# Altium schematic sheet samd21.SchDoc: Microcontroller
size A; Engineer: A. Peck; Organization: UCLA High Energy Physics; DocumentNumber: 3; Revision: 3.0; SheetNumber: 3; SheetTotal: 15; Project: LCT Comparator Tester
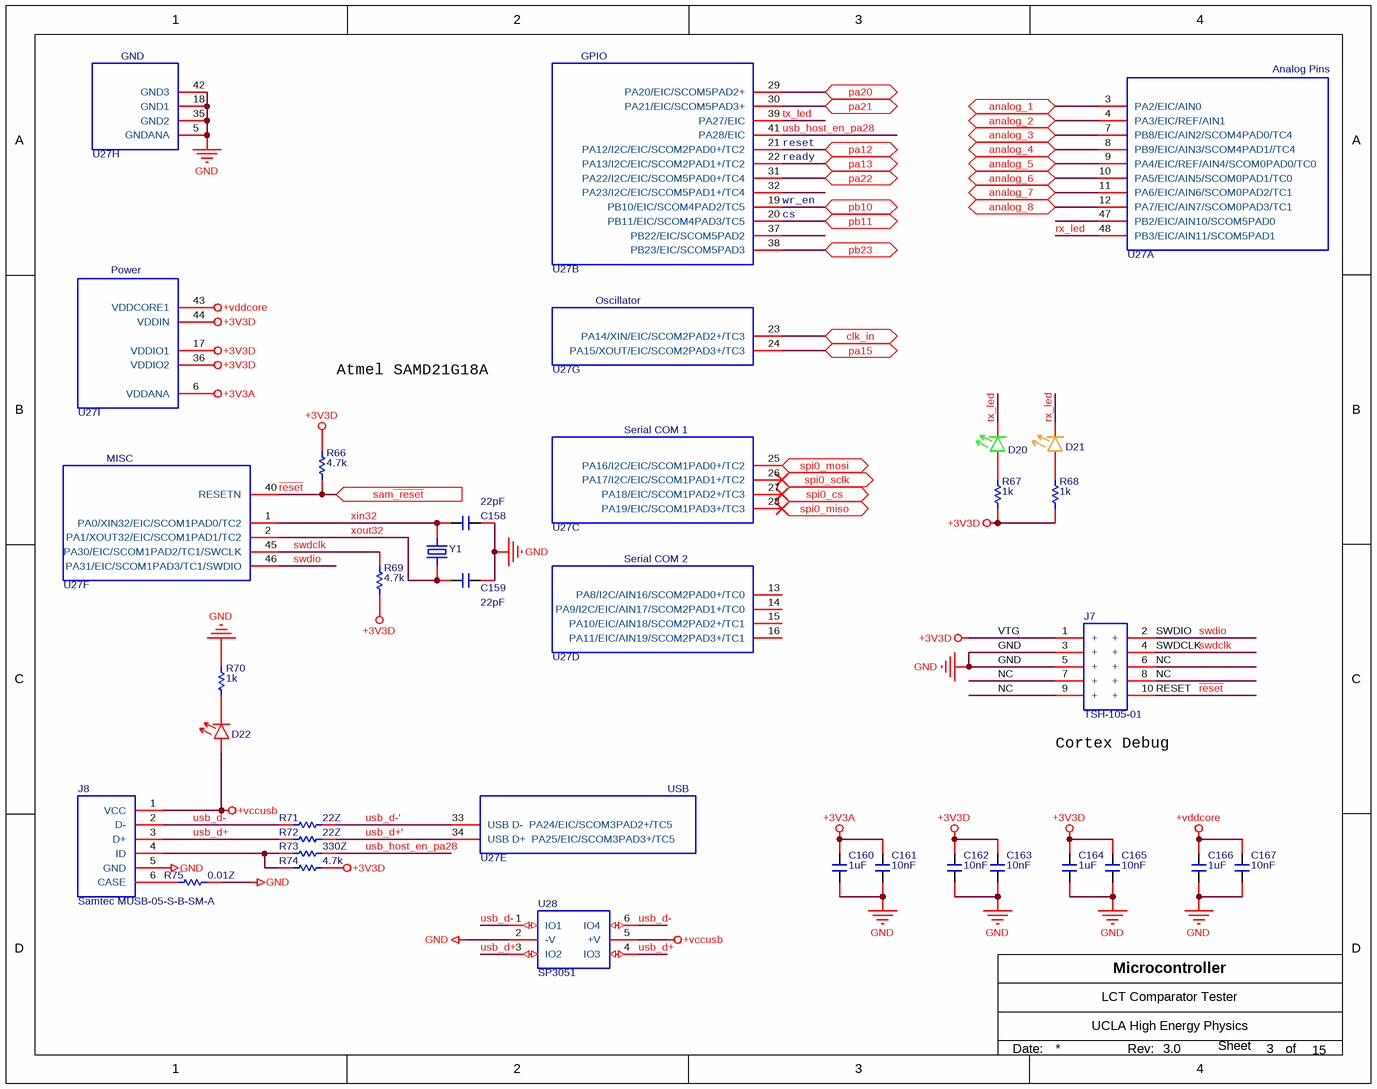
[diagram p0: samd21.SchDoc]

## Parts
C158  22pF  [C0603]
C159  22pF  [C0603]
C160  1uF  [C0603]
C161  10nF  [C0603]
C162  10nF  [C0603]
C163  10nF  [C0603]
C164  1uF  [C0603]
C165  10nF  [C0603]
C166  1uF  [C0603]
C167  10nF  [C0603]
D20  LITEON/LTST-C191KGKT  [LED0603]  (value not drawn)
D21  Vishay/TLMO1000-GS08  [LED0603]  (value not drawn)
D22  Vishay/TLMS1000-GS08  [LED0603]  (value not drawn)
J7  TSH-105-01  [Samtec/FTSH-105-XX-XXX-DV-A]
J8  Samtec MUSB-05-S-B-SM-A  [MUSB-05-S-B-SM-A]
R66  4.7k  [R0603]
R67  1k  [R0603]
R68  1k  [R0603]
R69  4.7k  [R0603]
R70  1k  [R0603]
R71  22Z  [R0402]
R72  22Z  [R0402]
R73  330Z  [R0603]
R74  4.7k  [R0603]
R75  0.01Z  [R1206]
U27  SAMD21G18A-AUT  [TSQFP50P900X900X120-48N]  (value not drawn)  (parts A,B,C,D,E,F,G,H,I of 9)
U28  SP3051  [SOT23-6]
Y1  32.768 kHz  [ABRACON ABS07]  (value not drawn)

## Ports
analog_1 (bidir), analog_2 (bidir), analog_3 (bidir), analog_4 (bidir), analog_5 (bidir), analog_6 (bidir), analog_7 (bidir), analog_8 (bidir), clk_in (bidir), pa12 (bidir), pa13 (bidir), pa15 (bidir), pa20 (bidir), pa21 (bidir), pa22 (bidir), pb10 (bidir), pb11 (bidir), pb23 (bidir), sam~{_reset} (in), spi0_cs (out), spi0_miso (in), spi0_mosi (out), spi0_sclk (out)

## Nets
+3V3A: C160.2 C161.1 U27.6(VDDANA)
+3V3D: C162.2 C163.1 C164.1 C165.1 J7.1(+) R66.2 R67.1 R68.1 R69.1 R74.2 U27.17(VDDIO1) U27.36(VDDIO2) U27.44(VDDIN)
+vccusb: D22.A J8.1(VCC) U28.5(+V)
+vddcore: C166.1 C167.1 U27.43(VDDCORE1)
GND: C158.2 C159.2 C160.1 C161.2 C162.1 C163.2 C164.2 C165.2 C166.2 C167.2 J7.3(+) J7.5(+) J8.5(GND) R70.1 R75.2 U27.5(GNDANA) U27.18(GND1) U27.35(GND2) U27.42(GND3) U28.2(-V)
~{reset}: J7.10(+) R66.1 U27.40(RESETN) ; port sam~{_reset}
analog_1: U27.3(PA2/EIC/AIN0) ; port analog_1
analog_2: U27.4(PA3/EIC/REF/AIN1) ; port analog_2
analog_3: U27.7(PB8/EIC/AIN2/SCOM4PAD0/TC4) ; port analog_3
analog_4: U27.8(PB9/EIC/AIN3/SCOM4PAD1//TC4) ; port analog_4
analog_5: U27.9(PA4/EIC/REF/AIN4/SCOM0PAD0/TC0) ; port analog_5
analog_6: U27.10(PA5/EIC/AIN5/SCOM0PAD1/TC0) ; port analog_6
analog_7: U27.11(PA6/EIC/AIN6/SCOM0PAD2/TC1) ; port analog_7
analog_8: U27.12(PA7/EIC/AIN7/SCOM0PAD3/TC1) ; port analog_8
clk_in: U27.23(PA14/XIN/EIC/SCOM2PAD2+/TC3) ; port clk_in
pa12: U27.21(PA12/I2C/EIC/SCOM2PAD0+/TC2) ; port pa12
pa13: U27.22(PA13/I2C/EIC/SCOM2PAD1+/TC2) ; port pa13
pa15: U27.24(PA15/XOUT/EIC/SCOM2PAD3+/TC3) ; port pa15
pa20: U27.29(PA20/EIC/SCOM5PAD2+) ; port pa20
pa21: U27.30(PA21/EIC/SCOM5PAD3+) ; port pa21
pa22: U27.31(PA22/I2C/EIC/SCOM5PAD0+/TC4) ; port pa22
pb10: U27.19(PB10/EIC/SCOM4PAD2/TC5) ; port pb10
pb11: U27.20(PB11/EIC/SCOM4PAD3/TC5) ; port pb11
pb23: U27.38(PB23/EIC/SCOM5PAD3) ; port pb23
rx_led: D21.C U27.48(PB3/EIC/AIN11/SCOM5PAD1)
spi0_cs: U27.27(PA18/EIC/SCOM1PAD2+/TC3) ; port spi0_cs
spi0_miso: U27.28(PA19/EIC/SCOM1PAD3+/TC3) ; port spi0_miso
spi0_mosi: U27.25(PA16/I2C/EIC/SCOM1PAD0+/TC2) ; port spi0_mosi
spi0_sclk: U27.26(PA17/I2C/EIC/SCOM1PAD1+/TC2) ; port spi0_sclk
swdclk: J7.4(+) R69.2 U27.45(PA30/EIC/SCOM1PAD2/TC1/SWCLK)
swdio: J7.2(+) U27.46(PA31/EIC/SCOM1PAD3/TC1/SWDIO)
tx_led: D20.C U27.39(PA27/EIC)
usb_d+: J8.3(D+) R72.1 U28.3(IO2) U28.4(IO3)
usb_d+': R72.2 U27.34(USB_D+__PA25/EIC/SCOM3PAD3+/TC5)
usb_d-: J8.2(D-) R71.1 U28.1(IO1) U28.6(IO4)
usb_d-': R71.2 U27.33(USB_D-__PA24/EIC/SCOM3PAD2+/TC5)
usb_host_en_pa28: R73.2 U27.41(PA28/EIC)
xin32: C158.1 U27.1(PA0/XIN32/EIC/SCOM1PAD0/TC2) Y1.2
xout32: C159.1 U27.2(PA1/XOUT32/EIC/SCOM1PAD1/TC2) Y1.1
NetD20_A: D20.A R67.2
NetD21_A: D21.A R68.2
NetD22_C: D22.C R70.2
NetJ8_4: J8.4(ID) R73.1 R74.1
NetJ8_6: J8.6(CASE) R75.1

Not connected (* = marked no-connect by the designer): J7 6(+) 7(+) 8(+) 9(+); U27 13(PA8/I2C/AIN16/SCOM2PAD0+/TC0) 14(PA9/I2C/EIC/AIN17/SCOM2PAD1+/TC0) 15(PA10/EIC/AIN18/SCOM2PAD2+/TC1) 16(PA11/EIC/AIN19/SCOM2PAD3+/TC1) 32(PA23/I2C/EIC/SCOM5PAD1+/TC4) 37(PB22/EIC/SCOM5PAD2) 47(PB2/EIC/AIN10/SCOM5PAD0)

## Notes on the sheet
- (near U27) reset
- (near U27) ready
- (near U27) wr_en
- (near U27) cs
- Atmel SAMD21G18A
- NC
- GND
- VTG
- (near J7) SWDCLK
- (near J7) SWDIO
- (near J7) NC
- (near J7) Cortex Debug
- (near J7) RESET
- Date:
- Rev:
- of
- Sheet
- (in symbol Atmel/SAMD21G18A, part A) Analog Pins
- (in symbol Atmel/SAMD21G18A, part B) GPIO
- (in symbol Atmel/SAMD21G18A, part C) Serial COM 1
- (in symbol Atmel/SAMD21G18A, part D) Serial COM 2
- (in symbol Atmel/SAMD21G18A, part E) USB
- (in symbol Atmel/SAMD21G18A, part F) MISC
- (in symbol Atmel/SAMD21G18A, part G) Oscillator
- (in symbol Atmel/SAMD21G18A, part H) GND
- (in symbol Atmel/SAMD21G18A, part I) Power

## Library data of the parts
C158 C159 = CAP/C0603C220J1GACTU: CAP-CER, 0, 22pF, 10%, 100V, 0603, NP0; Manufacturer: Kemet; Tolerance: ±5%; Temperature Coefficient: C0G, NP0; Supplier 1: Digi-Key; Manufacturer Part Number: C0603C220J1GACTU; RoHS: RoHS Compliant; Category: Capacitors; Stock 1: 315216; Pricing 1: 1=0.1, 10=0.041, 50=0.0222, 100=0.0187, 250=0.01532, 500=0.0131, 1000=0.0102 (USD); Packaging: Cut Tape (CT); Capacitance: 22pF; Voltage - Rated: 100V; Mounting Type: Surface Mount, MLCC; Operating Temperature: -55°C ~ 125°C; Applications: General Purpose; Ratings: -; Package / Case: 0603 (1608 Metric); Size / Dimension: 0.063" L x 0.031" W (1.60mm x 0.80mm); Height - Seated (Max): -; Thickness (Max): 0.034" (0.87mm); Lead Spacing: -; Features: Low ESL; Lead Style: -; ComponentLink1URL: http://www.kemet.com/docfinder?Partnumber=C0603C220J1GACTU; ComponentLink1Description: http://www.kemet.com/docfinder?Partnumber=C0603C220J1GACTU; Supplier 2: Newark; Supplier Part Number 1: 399-7874-1-ND; Supplier Part Number 2: 06R5147
C160 C164 C166 = Murata/GRM188R61E105KA12D: CAP-CER, 2, 1.0uF, 10%, 25V, 0603; Manufacturer: Murata Electronics North America; Capacitance: 1µF; Temperature Coefficient: X5R; Supplier 1: Digi-Key; Supplier Part Number 1: 490-3897-1-ND; Manufacturer Part Number: GRM188R61E105KA12D; RoHS: RoHS Compliant; Category: Capacitors; Stock 1: 1899119; Pricing 1: 1=0.1, 10=0.036, 50=0.0196, 100=0.0165, 250=0.01352, 500=0.01156, 1000=0.009 (USD); Packaging: Cut Tape (CT); Tolerance: ±10%; Voltage - Rated: 25V; Mounting Type: Surface Mount, MLCC; Operating Temperature: -55°C ~ 85°C; Applications: General Purpose; Ratings: -; Package / Case: 0603 (1608 Metric); Size / Dimension: 0.063" L x 0.031" W (1.60mm x 0.80mm); Height - Seated (Max): -; Thickness (Max): 0.035" (0.90mm); Lead Spacing: -; Features: -; Lead Style: -; ComponentLink1URL: http://www.murata.com/~/media/webrenewal/support/library/catalog/products/capacitor/mlcc/c02e.pdf; ComponentLink1Description: http://www.murata.com/~/media/webrenewal/support/library/catalog/products/capacitor/mlcc/c02e.pdf
C161-C163 C165 C167 = CAP/GRM188R71H103KA01D: CAP-CER, 2, 0.01uF, 10%, 50V, X7R, 0603; Manufacturer: Murata Electronics North America; Capacitance: 10000pF; Supplier 1: Digi-Key; Manufacturer Part Number: GRM188R71H103KA01D; RoHS: RoHS Compliant; Category: Capacitors; Stock 1: 3035311; Pricing 1: 1=0.1, 10=0.019, 50=0.01, 100=0.0085, 250=0.00696, 500=0.00596, 1000=0.00465 (USD); Packaging: Cut Tape (CT); Tolerance: ±10%; Voltage - Rated: 50V; Temperature Coefficient: X7R; Mounting Type: Surface Mount, MLCC; Operating Temperature: -55°C ~ 125°C; Applications: General Purpose; Ratings: -; Package / Case: 0603 (1608 Metric); Size / Dimension: 0.063" L x 0.031" W (1.60mm x 0.80mm); Height - Seated (Max): -; Thickness (Max): 0.035" (0.90mm); Lead Spacing: -; Features: -; Lead Style: -; ComponentLink1URL: http://www.murata.com/~/media/webrenewal/support/library/catalog/products/capacitor/mlcc/c02e.pdf; ComponentLink1Description: http://www.murata.com/~/media/webrenewal/support/library/catalog/products/capacitor/mlcc/c02e.pdf; Supplier Part Number 1: 490-1512-1-ND; Supplier 2: Newark; Supplier Part Number 2: 38K1669
D20 = LITEON/LTST-C191KGKT: LED, 20mA, 0603, Green; Supplier 1: Digi-Key; Supplier Part Number 1: 160-1446-1-ND
D21 = Vishay/TLMO1000-GS08: LED, 2mA, 0603, Soft Orange; Manufacturer: Vishay Semiconductor Opto Division; Millicandela Rating: 7.5mcd; Lens Style/Size: Rectangle with Flat Top, 1.60mm x 0.80mm; Voltage - Forward (Vf) (Typ): 1.8V; Viewing Angle: 160°; Wavelength - Dominant: 605nm; Wavelength - Peak: 610nm; Supplier 1: Digi-Key; Manufacturer Part Number: TLMO1000-GS08; RoHS: RoHS Compliant; Category: Optoelectronics; Stock 1: 182; Pricing 1: 1=0.52, 10=0.372, 25=0.304, 100=0.2432, 250=0.20524, 500=0.17482, 1000=0.13682 (USD); Packaging: Cut Tape (CT); Color: Orange; Lens Color: -; Lens Transparency: -; Current - Test: 2mA; Mounting Type: Surface Mount; Features: -; Package / Case: 0603 (1608 Metric); Supplier Device Package: 0603; Size / Dimension: 1.60mm L x 0.80mm W; Height (Max): 0.65mm; ComponentLink1URL: http://www.vishay.com/docs/83172/tlmo1000.pdf; ComponentLink1Description: http://www.vishay.com/docs/83172/tlmo1000.pdf; Supplier Part Number 1: TLMO1000-GS08CT-ND
D22 = Vishay/TLMS1000-GS08: LED, 2mA, 0603, Red; Manufacturer: Vishay Semiconductor Opto Division; Millicandela Rating: 4mcd; Lens Style/Size: Rectangle with Flat Top, 1.60mm x 0.80mm; Voltage - Forward (Vf) (Typ): 1.8V; Viewing Angle: 160°; Wavelength - Dominant: 628nm; Wavelength - Peak: 640nm; Supplier 1: Digi-Key; Manufacturer Part Number: TLMS1000-GS08; RoHS: RoHS Compliant; Category: Optoelectronics; Stock 1: 12598; Pricing 1: 1=0.52, 10=0.372, 25=0.304, 100=0.2432, 250=0.20524, 500=0.17482, 1000=0.13682 (USD); Packaging: Cut Tape (CT); Color: Red; Lens Color: -; Lens Transparency: -; Current - Test: 2mA; Mounting Type: Surface Mount; Features: -; Package / Case: 0603 (1608 Metric); Supplier Device Package: 0603; Size / Dimension: 1.60mm L x 0.80mm W; Height (Max): 0.65mm; ComponentLink1URL: http://www.vishay.com/docs/83172/tlmo1000.pdf; ComponentLink1Description: http://www.vishay.com/docs/83172/tlmo1000.pdf; Supplier 2: Newark; Supplier Part Number 1: TLMS1000-GS08CT-ND; Supplier Part Number 2: 35M3052
J7 = Samtec/TSH-105-01: Header, 1.27mm, 02x05; Manufacturer: Samtec Inc.; Manufacturer Part Number: FTSH-105-01-F-DV-K; Connector Type: Header, Shrouded; Number of Positions: 10; Number of Positions Loaded: All; Pitch: 0.050" (1.27mm); Supplier 1: Digi-Key; RoHS: RoHS Compliant; Category: Connectors, Interconnects; Stock 1: 4301; Pricing 1: 1=3.02, 10=2.552, 50=2.204, 100=1.972, 250=1.74, 500=1.624, 1000=1.508, 2500=1.45, 5000=1.421 (USD); Packaging: Tube; Contact Type: Male Pin; Number of Rows: 2; Row Spacing: 0.050" (1.27mm); Contact Mating Length: 0.120" (3.05mm); Mounting Type: Surface Mount; Termination: Solder; Fastening Type: -; Features: -; Contact Finish: Gold; Contact Finish Thickness: 3µin (0.08µm); Color: Black; ComponentLink1URL: http://suddendocs.samtec.com/prints/ftsh-1xx-xx-xxx-dv-xxx-mkt.pdf; ComponentLink1Description: http://suddendocs.samtec.com/prints/ftsh-1xx-xx-xxx-dv-xxx-mkt.pdf; Supplier Part Number 1: SAM8796-ND
J8 = Samtec/MUSB-05-S-B-SM-A: USB, Mini-USB, SMD; Manufacturer: Samtec Inc.; Connector Type: USB - mini B; Number of Contacts: 5; Gender: Receptacle; Specifications: USB 2.0; Supplier 1: Digi-Key; Manufacturer Part Number: MUSB-05-S-B-SM-A; RoHS: RoHS Compliant; Stock 1: 1209; Pricing 1: 1=1.48, 10=1.222, 50=1.018, 100=0.9162, 250=0.84496, 500=0.7635, 1000=0.67697, 2500=0.64898, 5000=0.63625 (USD); ComponentLink1URL: http://suddendocs.samtec.com/prints/musb-05-x-b-sm-a-x-xx-mkt.pdf; ComponentLink1Description: http://suddendocs.samtec.com/prints/musb-05-x-b-sm-a-x-xx-mkt.pdf; Supplier Part Number 1: SAM8841-ND; Category: Connectors, Interconnects; Packaging: Tray; Mounting Type: Surface Mount, Right Angle, Horizontal; Features: Board Guide, Solder Retention; Ingress Protection: -
R66 R69 R74 = CRCW06034K70FKEA: RES1, SMD, 4.70k, 1.0%, 1/10W, 0603; Manufacturer: Vishay Dale; Tolerance: ±1%; Power (Watts): 0.1W, 1/10W; Temperature Coefficient: ±100ppm/°C; Supplier 1: Digi-Key; Manufacturer Part Number: CRCW06034K70FKEA; RoHS: RoHS Compliant; Category: Resistors; Stock 1: 413202; Pricing 1: 1=0.1, 10=0.03, 25=0.022, 50=0.0168, 100=0.0123, 250=0.0094, 500=0.00752, 1000=0.00554, 2500=0.00481 (USD); Packaging: Cut Tape (CT); Resistance (Ohms): 4.7k; Composition: Thick Film; Features: Automotive AEC-Q200; Operating Temperature: -55°C ~ 155°C; Package / Case: 0603 (1608 Metric); Supplier Device Package: 0603; Size / Dimension: 0.063" L x 0.033" W (1.60mm x 0.85mm); Number of Terminations: 2; ComponentLink1URL: http://www.vishay.com/docs/20035/dcrcwe3.pdf; ComponentLink1Description: http://www.vishay.com/docs/20035/dcrcwe3.pdf; Supplier Part Number 1: 541-4.70KHCT-ND; Part Status: Active; Height - Seated (Max): 0.020" (0.50mm); Failure Rate: -
R67 R68 R70 = CRCW06031K00FKEA: RES1, SMD, 1.00k, 1.0%, 1/10W, 0603; Manufacturer: Vishay Dale; Tolerance: ±1%; Power (Watts): 0.1W, 1/10W; Temperature Coefficient: ±100ppm/°C; Supplier 1: Digi-Key; Supplier Part Number 1: 541-1.00KHCT-ND; Manufacturer Part Number: CRCW06031K00FKEA; RoHS: RoHS Compliant; Category: Resistors; Stock 1: 770011; Pricing 1: 1=0.1, 10=0.03, 25=0.022, 50=0.0168, 100=0.0123, 250=0.0094, 500=0.00752, 1000=0.00554, 2500=0.00481 (USD); Packaging: Cut Tape (CT); Resistance (Ohms): 1k; Composition: Thick Film; Features: Automotive AEC-Q200; Operating Temperature: -55°C ~ 155°C; Package / Case: 0603 (1608 Metric); Supplier Device Package: 0603; Size / Dimension: 0.061" L x 0.033" W (1.55mm x 0.85mm); Height: 0.020" (0.50mm); Number of Terminations: 2; ComponentLink1URL: http://www.vishay.com/docs/20035/dcrcwe3.pdf; ComponentLink1Description: http://www.vishay.com/docs/20035/dcrcwe3.pdf; Supplier 2: Newark; Supplier Part Number 2: 52K8015
R71 R72 = RES/ 311-22.0LRCT-ND: RES0, SMD, 22.0Z, 1.0%, 1/16W, 0402; Manufacturer: Yageo; Manufacturer Part Number: RC0402FR-0722RL; Resistance (Ohms): 22; Tolerance: ±1%; Power (Watts): 0.063W, 1/16W; Temperature Coefficient: ±100ppm/°C; RoHS: RoHS Compliant; Category: Resistors; Packaging: Cut Tape (CT); Composition: Thick Film; Features: Moisture Resistant; Operating Temperature: -55°C ~ 155°C; Package / Case: 0402 (1005 Metric); Supplier Device Package: 0402; Size / Dimension: 0.039" L x 0.020" W (1.00mm x 0.50mm); Height: 0.016" (0.40mm); Number of Terminations: 2; ComponentLink1URL: http://www.yageo.com/documents/recent/PYu-RC_Group_51_RoHS_L_04.pdf; ComponentLink1Description: http://www.yageo.com/documents/recent/PYu-RC_Group_51_RoHS_L_04.pdf; Supplier 1: Digi-Key; Stock 1: 1724839; Pricing 1: 1=0.1, 10=0.013, 25=0.0096, 100=0.0054, 250=0.00412, 500=0.00328, 1000=0.00242, 2500=0.0021, 5000=0.00173 (USD); Supplier Part Number 1: 311-22.0LRCT-ND; Supplier 2: Newark; Supplier Part Number 2: 67R9912
R73 = CRCW0603330RFKEA: RES0, SMD,  330Z, 1.0%, 1/10W, 0603; Manufacturer: Rohm Semiconductor; Manufacturer Part Number: MCR03ERTF3300; Resistance (Ohms): 330; Tolerance: ±1%; Power (Watts): 0.1W, 1/10W; Temperature Coefficient: ±100ppm/°C; Supplier 1: Digi-Key; RoHS: RoHS Compliant; Category: Resistors; Stock 1: 139947; Pricing 1: 1=0.1, 10=0.011, 25=0.0084, 100=0.0047, 250=0.00356, 500=0.00286, 1000=0.0021 (USD); Packaging: Cut Tape (CT); Composition: Thick Film; Features: -; Operating Temperature: -55°C ~ 155°C; Package / Case: 0603 (1608 Metric); Supplier Device Package: 0603 (1608 Metric); Size / Dimension: 0.063" L x 0.031" W (1.60mm x 0.80mm); Height: 0.022" (0.55mm); Number of Terminations: 2; ComponentLink1URL: http://rohmfs.rohm.com/en/products/databook/datasheet/passive/resistor/chip_resistor/mcr_g.pdf; ComponentLink1Description: http://rohmfs.rohm.com/en/products/databook/datasheet/passive/resistor/chip_resistor/mcr_g.pdf; Supplier Part Number 1: RHM330CFCT-ND
R75 = RES SMD 0.01 OHM 1% 1W 1206: RES0, SMD, 0.01Z, 1.0%, 1/4W,  1206; Manufacturer: Panasonic Electronic Components; Manufacturer Part Number: ERJ-8BWFR010V; Resistance (Ohms): 0.01; Tolerance: ±1%; Power (Watts): 1W; Temperature Coefficient: ±200ppm/°C; Supplier 1: Digi-Key; RoHS: RoHS Compliant; Category: Resistors; Stock 1: 27187; Pricing 1: 1=0.72, 50=0.464, 100=0.4038, 250=0.36084, 500=0.2921, 1000=0.23625 (USD); Packaging: Cut Tape (CT); Part Status: Active; Composition: Thick Film; Features: Automotive AEC-Q200, Current Sense; Operating Temperature: -55°C ~ 155°C; Package / Case: 1206 (3216 Metric); Supplier Device Package: 1206; Size / Dimension: 0.126" L x 0.063" W (3.20mm x 1.60mm); Height - Seated (Max): 0.030" (0.75mm); Number of Terminations: 2; Failure Rate: -; ComponentLink1URL: https://industrial.panasonic.com/cdbs/www-data/pdf/RDA0000/AOA0000C239.pdf; ComponentLink1Description: https://industrial.panasonic.com/cdbs/www-data/pdf/RDA0000/AOA0000C239.pdf; Supplier Part Number 1: P.010AUCT-ND
U27 = Atmel/SAMD21G18A: Atmel D21 32bit ARM Cortex-M0  microcontroller - 48 PIN TQFP 256KB flash memory + 32KB SRAM; Manufacturer Part Number: ATSAMD21G18A-AUT; Core Processor: ARM® Cortex®-M0+; Core Size: 32-Bit; Speed: 48MHz; Connectivity: I²C, LIN, SPI, UART/USART; Peripherals: Brown-out Detect/Reset, DMA, I²S, POR, PWM, WDT; Number of I/O: 38; Program Memory Size: 256KB (256K x 8); RAM Size: 32K x 8; Voltage - Supply (Vcc/Vdd): 1.62 V ~ 3.6 V; Data Converters: A/D 14x12b, D/A 1x10b; Oscillator Type: Internal; Supplier 1: Digi-Key; Manufacturer: Atmel; RoHS: RoHS Compliant; Category: Integrated Circuits (ICs); Stock 1: 1467; Pricing 1: 1=5.68, 10=5.073, 25=4.5656, 100=4.1599, 250=3.75404, 500=3.36848, 1000=2.84088 (USD); Packaging: Cut Tape (CT); Program Memory Type: FLASH; EEPROM Size: -; Operating Temperature: -40°C ~ 85°C (TA); Package / Case: 48-TQFP; Supplier Device Package: 48-TQFP (7x7); ComponentLink1URL: http://www.atmel.com/Images/Atmel-42181-SAM-D21_Summary.pdf; ComponentLink1Description: http://www.atmel.com/Images/Atmel-42181-SAM-D21_Summary.pdf; Supplier Part Number 1: ATSAMD21G18A-AUTCT-ND
U28 = Littelfuse/SP3051-04HTG: TVS, 6VWM, 16VC; Manufacturer: Littelfuse Inc.; Bidirectional Channels: 4; Voltage - Reverse Standoff (Typ): 6V (Max); Voltage - Breakdown (Min): 8V (Typ); Voltage - Clamping (Max) @ Ipp: 17V; Current - Peak Pulse (10/1000µs): 20A (8/20µs); Power - Peak Pulse: 400W; Power Line Protection: Yes; Supplier 1: Digi-Key; Manufacturer Part Number: SP3051-04HTG; RoHS: RoHS Compliant; Category: Circuit Protection; Stock 1: 7453; Pricing 1: 1=1.05, 10=0.925, 25=0.8352, 100=0.7308, 250=0.64092, 500=0.5684, 1000=0.4495 (USD); Packaging: Cut Tape (CT); Type: Steering (Rail to Rail); Unidirectional Channels: -; Applications: Ethernet; Capacitance @ Frequency: -; Operating Temperature: -40°C ~ 125°C (TJ); Mounting Type: Surface Mount; Package / Case: SOT-23-6; Supplier Device Package: SOT-23-6; ComponentLink1URL: http://www.littelfuse.com/~/media/electronics/datasheets/tvs_diode_arrays/littelfuse_tvs_diode_array_sp3051_datasheet.pdf.pdf; ComponentLink1Description: http://www.littelfuse.com/~/media/electronics/datasheets/tvs_diode_arrays/littelfuse_tvs_diode_array_sp3051_datasheet.pdf.pdf; Supplier 2: Newark; Supplier Part Number 1: F6279CT-ND; Supplier Part Number 2: 88W3903
Y1 = Abracon/ABS07-32.768KHZ-T: XTAL, 32.768 kHz, 12.5pF, SMD; Manufacturer: Abracon LLC; Frequency Tolerance: ±20ppm; ESR (Equivalent Series Resistance): 70 kOhm; Operating Mode: Fundamental; Supplier 1: Digi-Key; Manufacturer Part Number: ABS07-32.768KHZ-T; RoHS: RoHS Compliant; Category: Crystals and Oscillators; Stock 1: 889970; Pricing 1: 1=0.51, 10=0.448, 50=0.4182, 100=0.37, 500=0.34964, 1000=0.2923 (USD); Packaging: Cut Tape (CT); Type: kHz Crystal (Tuning Fork); Frequency: 32.768kHz; Frequency Stability: -; Load Capacitance: 12.5pF; Operating Temperature: -40°C ~ 85°C; Ratings: -; Mounting Type: Surface Mount; Package / Case: 2-SMD, No Lead; Size / Dimension: 0.126" L x 0.061" W (3.20mm x 1.50mm); Height: 0.035" (0.90mm); ComponentLink1URL: http://www.abracon.com/Resonators/ABS07.pdf; ComponentLink1Description: http://www.abracon.com/Resonators/ABS07.pdf; Supplier Part Number 1: 535-9542-1-ND